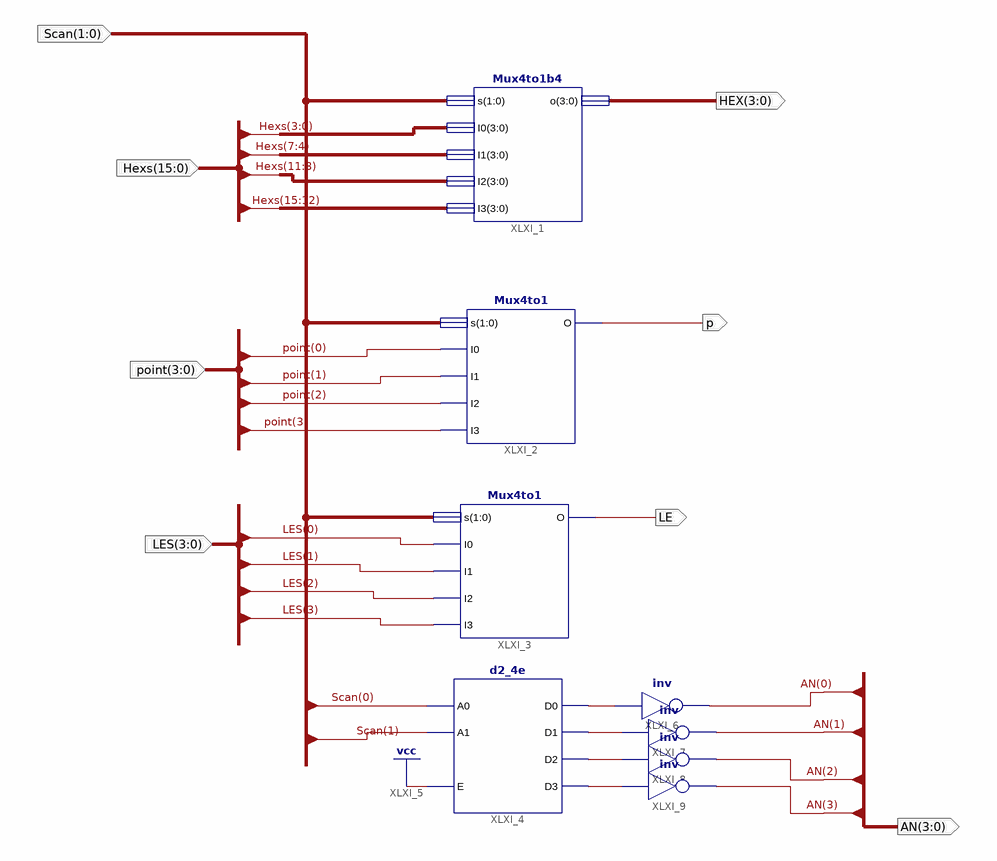
[diagram p0: schematic sheet 1]
// Xilinx ISE schematic DisplaySync.sch (kintex7) as structural Verilog: 8 symbols, 8 ports
module DisplaySync (
  input  [1:0] Scan,
  input  [3:0] point,
  input  [3:0] LES,
  input  [15:0] Hexs,
  output [3:0] HEX,
  output LE,
  output p,
  output [3:0] AN
);

  wire XLXN_17, XLXN_18, XLXN_19, XLXN_20;

  Mux4to1b4 XLXI_1 (.s(Scan), .I0(Hexs[3:0]), .I1(Hexs[7:4]), .I2(Hexs[11:8]), .I3(Hexs[15:12]), .o(HEX));
  Mux4to1 XLXI_2 (.s(Scan), .I0(point[0]), .I1(point[1]), .I2(point[2]), .I3(point[3]), .O(p));
  Mux4to1 XLXI_3 (.s(Scan), .I0(LES[0]), .I1(LES[1]), .I2(LES[2]), .I3(LES[3]), .O(LE));
  d2_4e XLXI_4 (.A0(Scan[0]), .A1(Scan[1]), .E(1'b1), .D0(XLXN_17), .D1(XLXN_18), .D2(XLXN_19), .D3(XLXN_20));
  not XLXI_6 (AN[0], XLXN_17);
  not XLXI_7 (AN[1], XLXN_18);
  not XLXI_8 (AN[2], XLXN_19);
  not XLXI_9 (AN[3], XLXN_20);
endmodule
